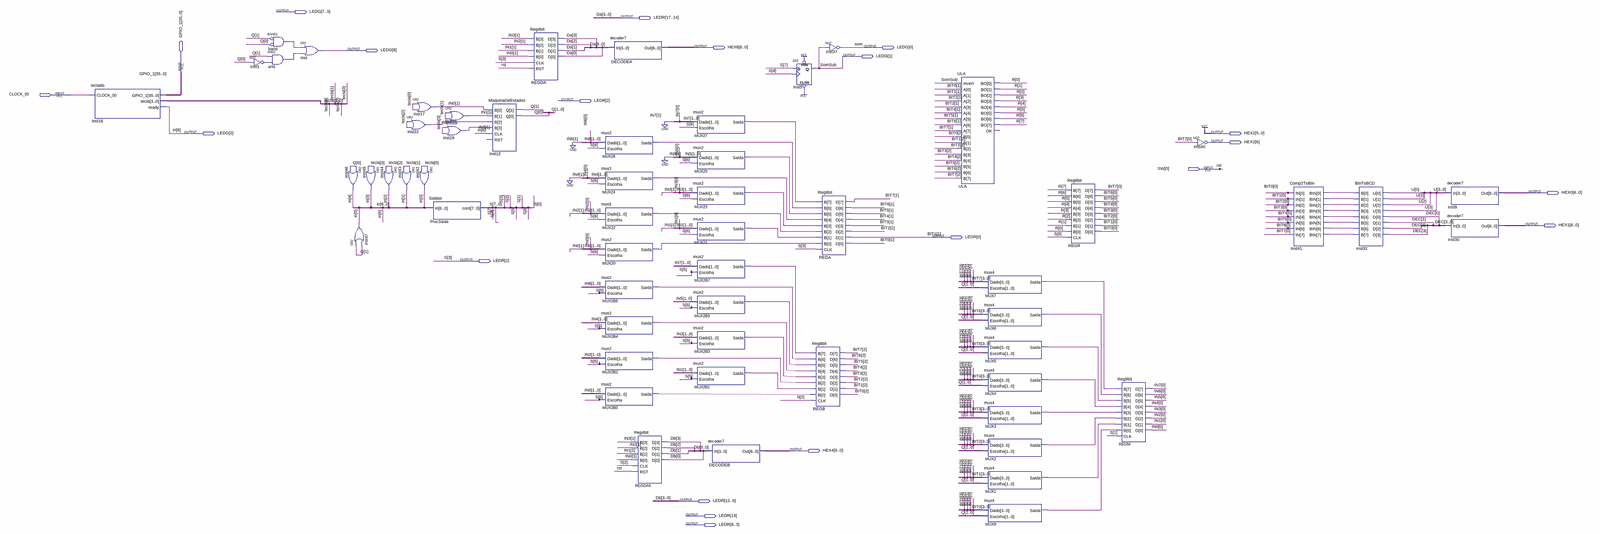
[diagram p0: schematic sheet, whole]
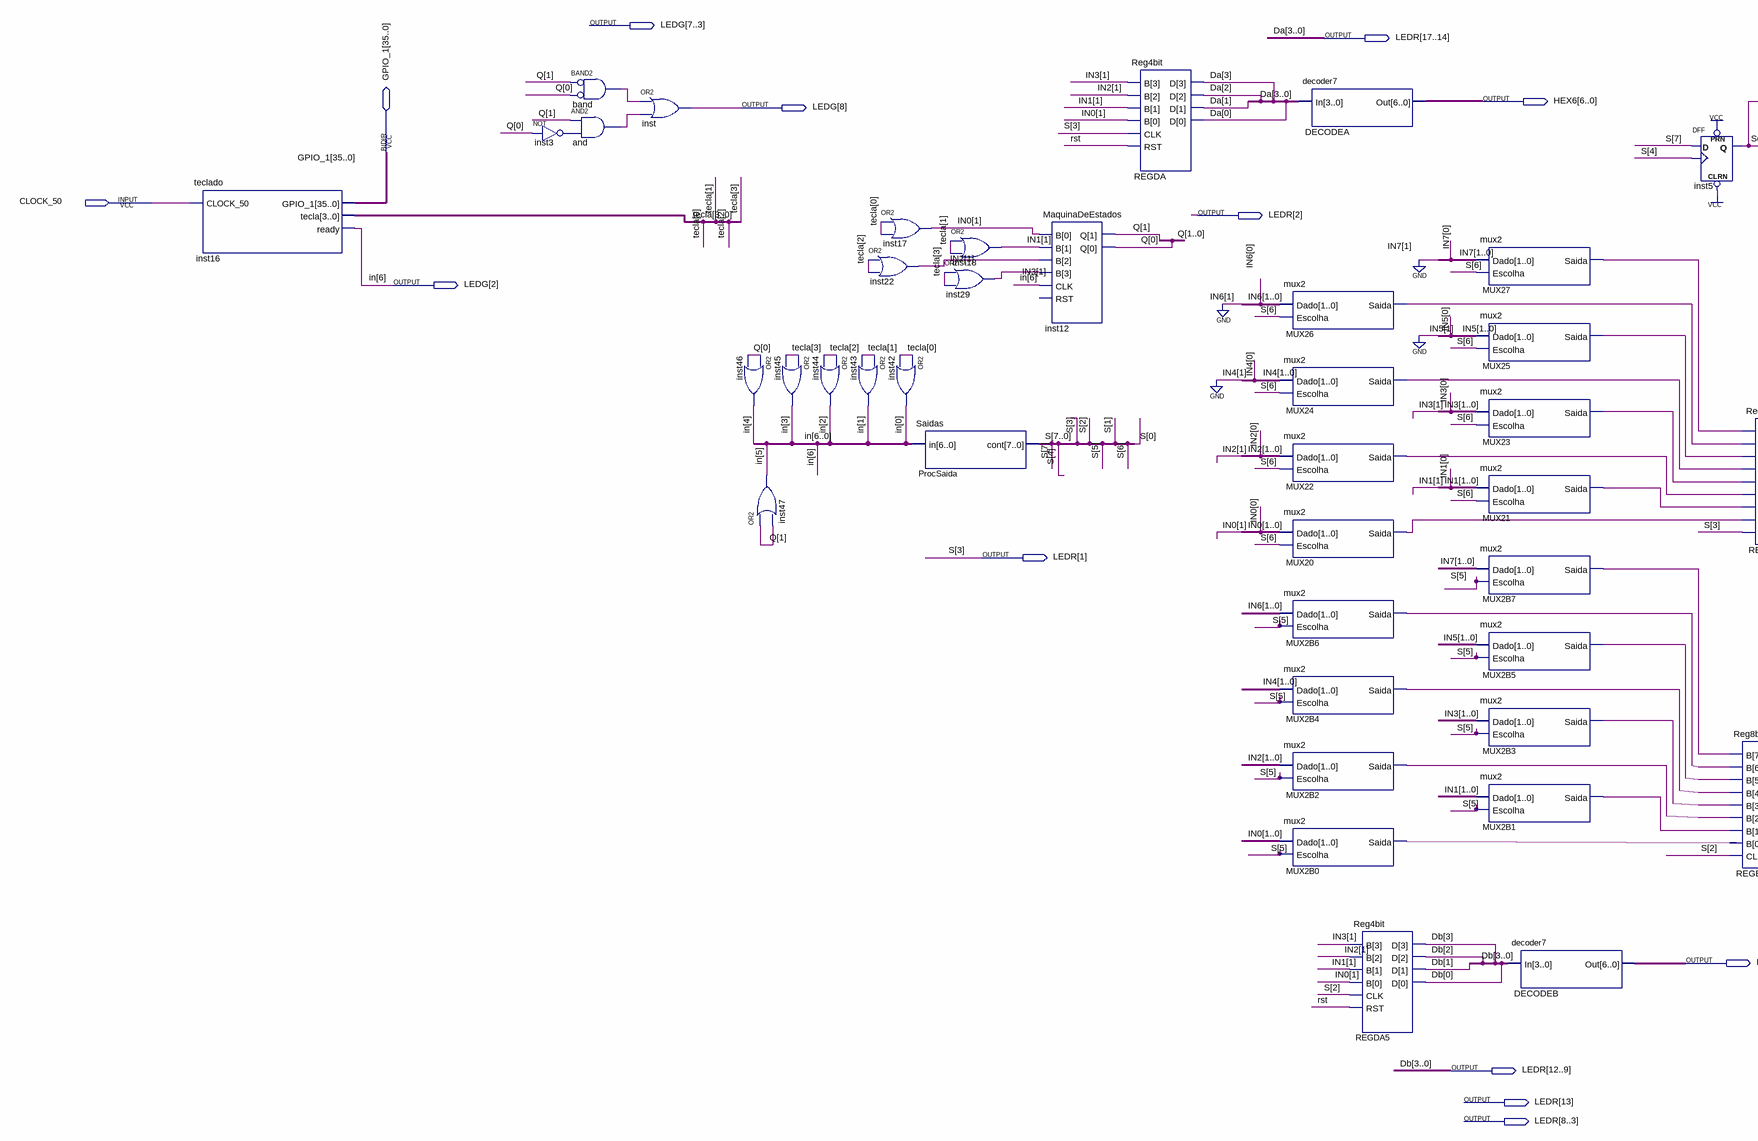
[diagram p1: schematic sheet, left part]
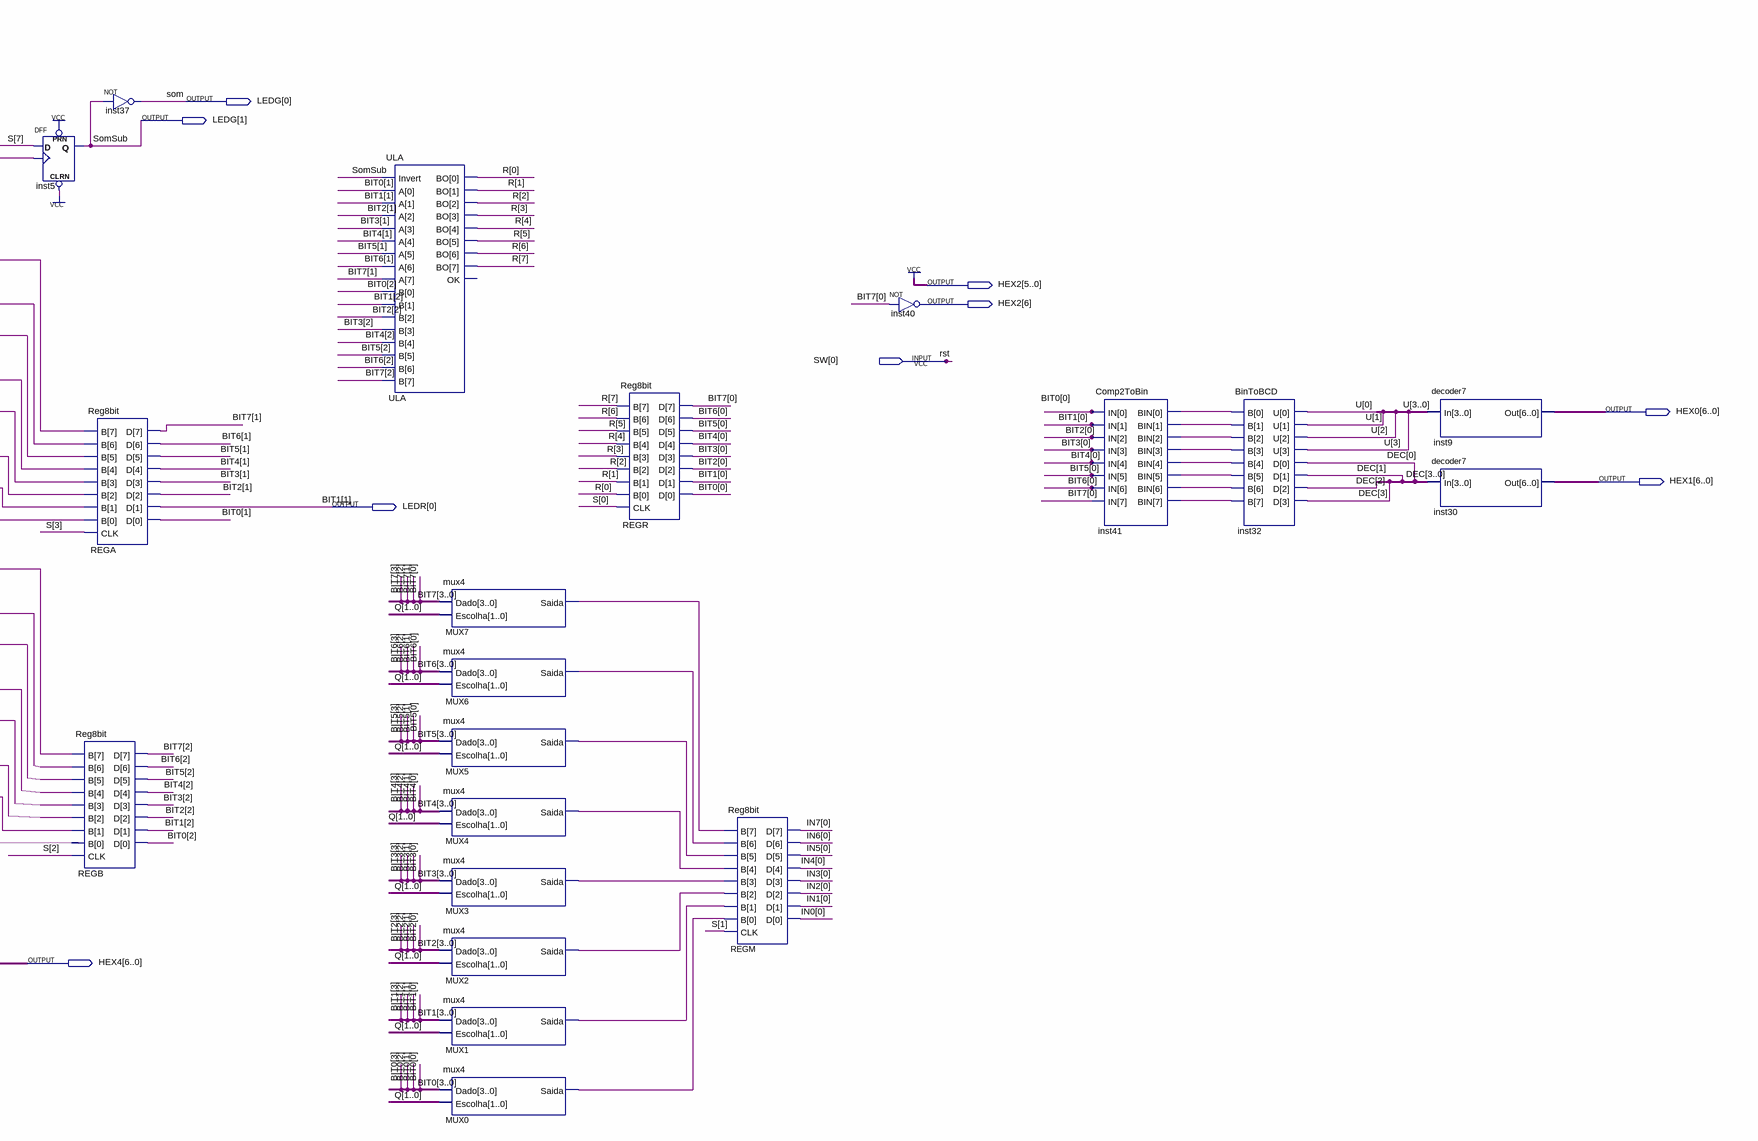
[diagram p2: schematic sheet, right part]
// Quartus schematic Calculadore.bdf as structural Verilog: 57 symbols, 21 pins
module Calculadore (
  input  CLOCK_50,
  input  [0:0] SW,
  inout  [35:0] GPIO_1,
  output [8:0] LEDG,
  output [17:0] LEDR,
  output [6:0] HEX6,
  output [6:0] HEX2,
  output [6:0] HEX0,
  output [6:0] HEX1,
  output [6:0] HEX4
);

  wire and_out, band_out, inst3_out, inst41_bin, inst41_bin_2, inst41_bin_3, inst41_bin_4, inst41_bin_5,
       inst41_bin_6, inst41_bin_7, inst41_bin_8, MUX0_saida, MUX1_saida, MUX2_saida, MUX2B0_saida,
       MUX2B1_saida, MUX2B2_saida, MUX2B3_saida, MUX2B4_saida, MUX2B5_saida, MUX2B6_saida, MUX2B7_saida,
       MUX3_saida, MUX4_saida, MUX5_saida, MUX6_saida, MUX7_saida, MUX20_saida, MUX21_saida, MUX22_saida,
       MUX23_saida, MUX24_saida, MUX25_saida, MUX26_saida, MUX27_saida;
  wire [0:0] IN4, IN5, IN6, IN7;
  wire [1:0] IN0, IN1, IN2, IN3, Q;
  wire [3:0] BIT0, BIT1, BIT2, BIT3, BIT4, BIT5, BIT6, BIT7, DEC, tecla, U;
  wire [5:0] in;
  wire [7:0] R, S;

  teclado inst16 (.CLOCK_50(CLOCK_50), .tecla(tecla), .ready(LEDG[2]), .GPIO_1(GPIO_1));
  not inst3 (inst3_out, Q[0]);
  and band (band_out, ~Q[1], ~Q[0]);  // BAND2
  and \and  (and_out, Q[1], inst3_out);
  or inst (LEDG[8], band_out, and_out);
  or inst46 (in[4], Q[0], Q[0]);
  or inst45 (in[3], tecla[3], tecla[3]);
  or inst47 (in[5], Q[1], Q[1]);
  or inst44 (in[2], tecla[2], tecla[2]);
  or inst17 (IN0[1], tecla[0], tecla[0]);
  or inst22 (IN2[1], tecla[2], tecla[2]);
  or inst42 (in[0], tecla[0], tecla[0]);
  or inst43 (in[1], tecla[1], tecla[1]);
  Saidas ProcSaida (.in({LEDG[2], in}), .cont({S[7:4], LEDR[1], S[2:0]}));
  or inst18 (IN1[1], tecla[1], tecla[1]);
  or inst29 (IN3[1], tecla[3], tecla[3]);
  MaquinaDeEstados inst12 (.B({IN3[1], IN2[1], IN1[1], IN0[1]}), .CLK(LEDG[2]), .Q(Q));  // open: RST
  Reg4bit REGDA (.B({IN3[1], IN2[1], IN1[1], IN0[1]}), .CLK(LEDR[1]), .RST(SW[0]), .D(LEDR[17:14]));
  mux2 MUX26 (.Dado({1'b0, IN6[0]}), .Escolha(S[6]), .Saida(MUX26_saida));
  mux2 MUX24 (.Dado({1'b0, IN4[0]}), .Escolha(S[6]), .Saida(MUX24_saida));
  mux2 MUX22 (.Dado(IN2), .Escolha(S[6]), .Saida(MUX22_saida));
  mux2 MUX20 (.Dado(IN0), .Escolha(S[6]), .Saida(MUX20_saida));
  mux2 MUX2B6 (.Dado({1'b0, IN6[0]}), .Escolha(S[5]), .Saida(MUX2B6_saida));
  mux2 MUX2B4 (.Dado({1'b0, IN4[0]}), .Escolha(S[5]), .Saida(MUX2B4_saida));
  mux2 MUX2B2 (.Dado(IN2), .Escolha(S[5]), .Saida(MUX2B2_saida));
  mux2 MUX2B0 (.Dado(IN0), .Escolha(S[5]), .Saida(MUX2B0_saida));
  decoder7 DECODEA (.In(LEDR[17:14]), .Out(HEX6));
  Reg4bit REGDA5 (.B({IN3[1], IN2[1], IN1[1], IN0[1]}), .CLK(S[2]), .RST(SW[0]), .D(LEDR[12:9]));
  mux2 MUX27 (.Dado({1'b0, IN7[0]}), .Escolha(S[6]), .Saida(MUX27_saida));
  mux2 MUX25 (.Dado({1'b0, IN5[0]}), .Escolha(S[6]), .Saida(MUX25_saida));
  mux2 MUX23 (.Dado(IN3), .Escolha(S[6]), .Saida(MUX23_saida));
  mux2 MUX21 (.Dado(IN1), .Escolha(S[6]), .Saida(MUX21_saida));
  mux2 MUX2B7 (.Dado({1'b0, IN7[0]}), .Escolha(S[5]), .Saida(MUX2B7_saida));
  mux2 MUX2B5 (.Dado({1'b0, IN5[0]}), .Escolha(S[5]), .Saida(MUX2B5_saida));
  mux2 MUX2B3 (.Dado(IN3), .Escolha(S[5]), .Saida(MUX2B3_saida));
  mux2 MUX2B1 (.Dado(IN1), .Escolha(S[5]), .Saida(MUX2B1_saida));
  decoder7 DECODEB (.In(LEDR[12:9]), .Out(HEX4));
  DFF inst5 (.CLRN(1'b1), .CLK(S[4]), .D(S[7]), .PRN(1'b1), .Q(LEDG[1]));
  Reg8bit REGA (
    .B({MUX27_saida, MUX26_saida, MUX25_saida, MUX24_saida, MUX23_saida, MUX22_saida, MUX21_saida, MUX20_saida}),
    .CLK(LEDR[1]), .D({BIT7[1], BIT6[1], BIT5[1], BIT4[1], BIT3[1], BIT2[1], LEDR[0], BIT0[1]}));
  Reg8bit REGB (
    .B({MUX2B7_saida, MUX2B6_saida, MUX2B5_saida, MUX2B4_saida, MUX2B3_saida, MUX2B2_saida, MUX2B1_saida, MUX2B0_saida}),
    .CLK(S[2]), .D({BIT7[2], BIT6[2], BIT5[2], BIT4[2], BIT3[2], BIT2[2], BIT1[2], BIT0[2]}));
  not inst37 (LEDG[0], LEDG[1]);
  ULA ULA (
    .Invert(LEDG[1]), .A({BIT7[1], BIT6[1], BIT5[1], BIT4[1], BIT3[1], BIT2[1], LEDR[0], BIT0[1]}),
    .B({BIT7[2], BIT6[2], BIT5[2], BIT4[2], BIT3[2], BIT2[2], BIT1[2], BIT0[2]}), .BO(R));  // open: OK
  mux4 MUX7 (.Dado(BIT7), .Escolha(Q), .Saida(MUX7_saida));
  mux4 MUX6 (.Dado(BIT6), .Escolha(Q), .Saida(MUX6_saida));
  mux4 MUX5 (.Dado(BIT5), .Escolha(Q), .Saida(MUX5_saida));
  mux4 MUX4 (.Dado(BIT4), .Escolha(Q), .Saida(MUX4_saida));
  mux4 MUX3 (.Dado(BIT3), .Escolha(Q), .Saida(MUX3_saida));
  mux4 MUX2 (.Dado(BIT2), .Escolha(Q), .Saida(MUX2_saida));
  mux4 MUX1 (.Dado({BIT1[3:2], LEDR[0], BIT1[0]}), .Escolha(Q), .Saida(MUX1_saida));
  mux4 MUX0 (.Dado(BIT0), .Escolha(Q), .Saida(MUX0_saida));
  Reg8bit REGR (.B(R), .CLK(S[0]), .D({BIT7[0], BIT6[0], BIT5[0], BIT4[0], BIT3[0], BIT2[0], BIT1[0], BIT0[0]}));
  Reg8bit REGM (
    .B({MUX7_saida, MUX6_saida, MUX5_saida, MUX4_saida, MUX3_saida, MUX2_saida, MUX1_saida, MUX0_saida}),
    .CLK(S[1]), .D({IN7[0], IN6[0], IN5[0], IN4[0], IN3[0], IN2[0], IN1[0], IN0[0]}));
  not inst40 (HEX2[6], BIT7[0]);
  Comp2ToBin inst41 (
    .IN({BIT7[0], BIT6[0], BIT5[0], BIT4[0], BIT3[0], BIT2[0], BIT1[0], BIT0[0]}),
    .BIN({inst41_bin_8, inst41_bin_7, inst41_bin_6, inst41_bin_5, inst41_bin_4, inst41_bin_3, inst41_bin_2, inst41_bin}));
  BinToBCD inst32 (
    .B({inst41_bin_8, inst41_bin_7, inst41_bin_6, inst41_bin_5, inst41_bin_4, inst41_bin_3, inst41_bin_2, inst41_bin}),
    .U(U), .D(DEC));
  decoder7 inst9 (.In(U), .Out(HEX0));
  decoder7 inst30 (.In(DEC), .Out(HEX1));

  assign HEX2[5:0] = {6{1'b1}};

  // Other names for the same wires on the sheet: BIT1[1] = LEDR[0]; Da[3:0] = LEDR[17:14]; Db[3:0] = LEDR[12:9];
  //   in[6] = LEDG[2]; SomSub = LEDG[1]; rst = SW[0]; S[3] = LEDR[1]; som = LEDG[0]
endmodule
